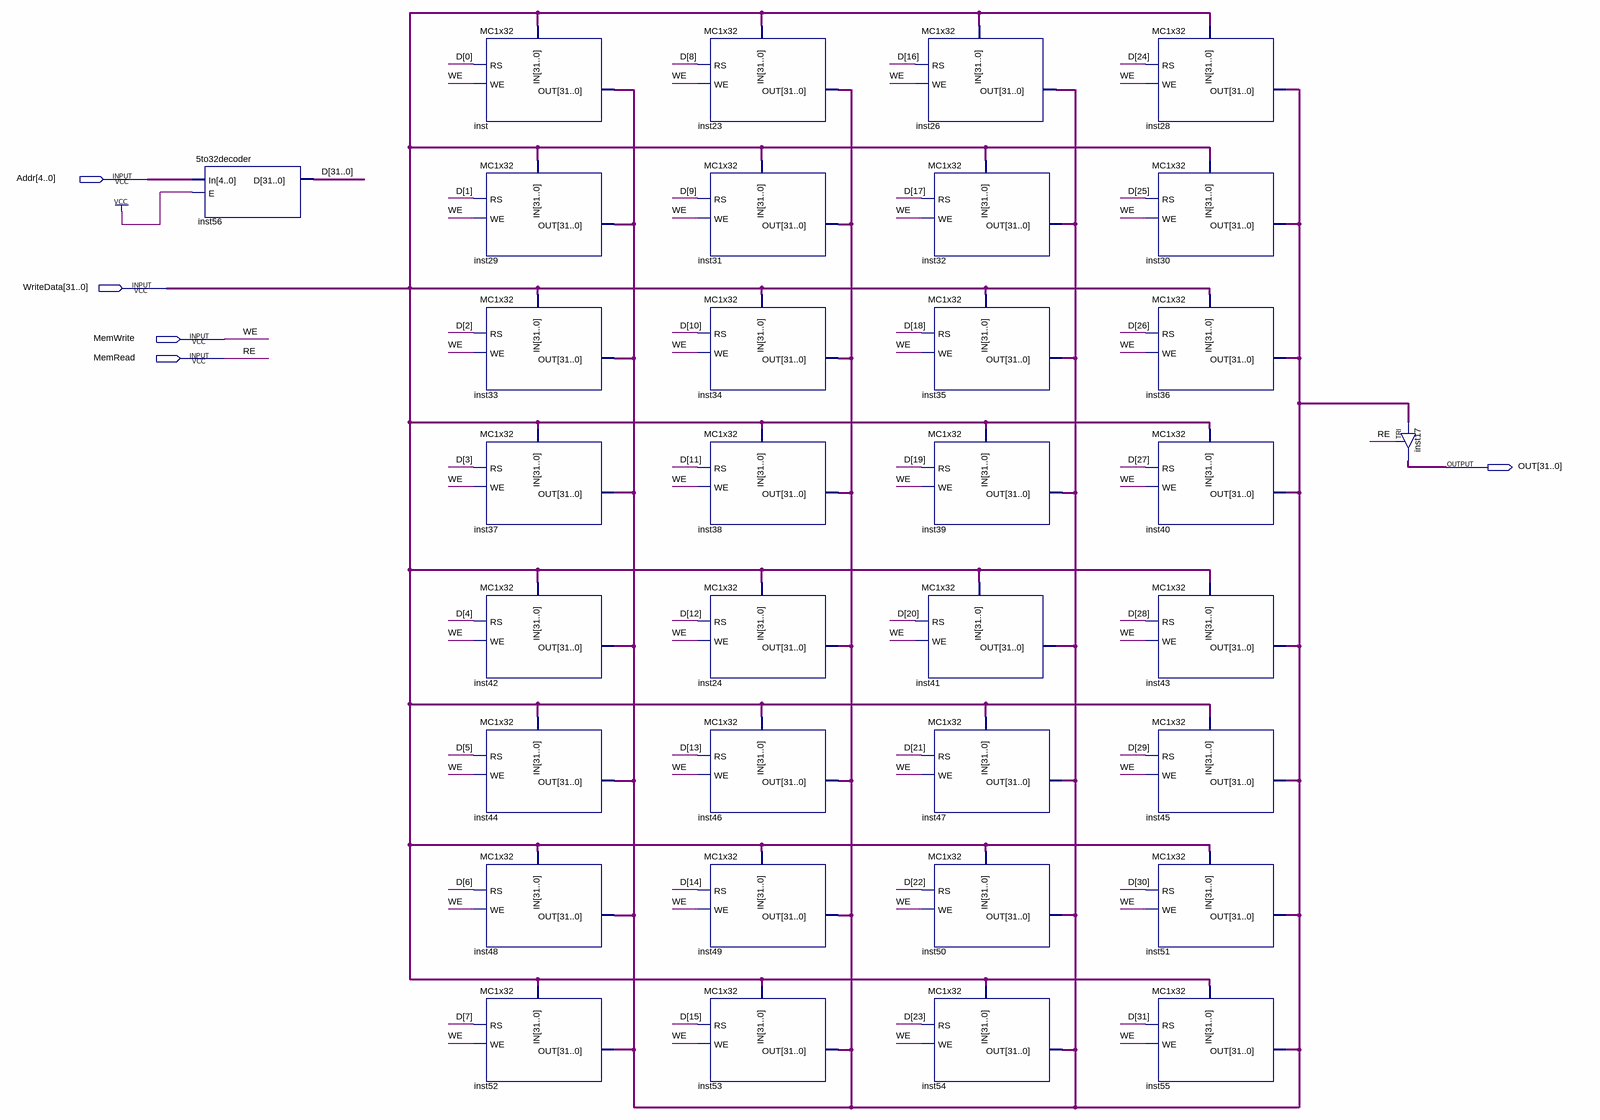
[diagram p0: schematic sheet]
// Quartus schematic RAM32x32.bdf as structural Verilog: 34 symbols, 5 pins
module RAM32x32 (
  input  [4:0] Addr,
  input  [31:0] WriteData,
  input  MemWrite,
  input  MemRead,
  output [31:0] OUT
);

  wire [31:0] D, inst_out;

  \5to32decoder  inst56 (.In(Addr), .E(1'b1), .D(D));
  MC1x32 inst (.RS(D[0]), .IN(WriteData), .WE(MemWrite), .OUT(inst_out));
  MC1x32 inst29 (.RS(D[1]), .IN(WriteData), .WE(MemWrite), .OUT(inst_out));
  MC1x32 inst33 (.RS(D[2]), .IN(WriteData), .WE(MemWrite), .OUT(inst_out));
  MC1x32 inst37 (.RS(D[3]), .IN(WriteData), .WE(MemWrite), .OUT(inst_out));
  MC1x32 inst42 (.RS(D[4]), .IN(WriteData), .WE(MemWrite), .OUT(inst_out));
  MC1x32 inst44 (.RS(D[5]), .IN(WriteData), .WE(MemWrite), .OUT(inst_out));
  MC1x32 inst48 (.RS(D[6]), .IN(WriteData), .WE(MemWrite), .OUT(inst_out));
  MC1x32 inst52 (.RS(D[7]), .IN(WriteData), .WE(MemWrite), .OUT(inst_out));
  MC1x32 inst23 (.RS(D[8]), .IN(WriteData), .WE(MemWrite), .OUT(inst_out));
  MC1x32 inst31 (.RS(D[9]), .IN(WriteData), .WE(MemWrite), .OUT(inst_out));
  MC1x32 inst34 (.RS(D[10]), .IN(WriteData), .WE(MemWrite), .OUT(inst_out));
  MC1x32 inst38 (.RS(D[11]), .IN(WriteData), .WE(MemWrite), .OUT(inst_out));
  MC1x32 inst24 (.RS(D[12]), .IN(WriteData), .WE(MemWrite), .OUT(inst_out));
  MC1x32 inst46 (.RS(D[13]), .IN(WriteData), .WE(MemWrite), .OUT(inst_out));
  MC1x32 inst49 (.RS(D[14]), .IN(WriteData), .WE(MemWrite), .OUT(inst_out));
  MC1x32 inst53 (.RS(D[15]), .IN(WriteData), .WE(MemWrite), .OUT(inst_out));
  MC1x32 inst26 (.RS(D[16]), .IN(WriteData), .WE(MemWrite), .OUT(inst_out));
  MC1x32 inst32 (.RS(D[17]), .IN(WriteData), .WE(MemWrite), .OUT(inst_out));
  MC1x32 inst35 (.RS(D[18]), .IN(WriteData), .WE(MemWrite), .OUT(inst_out));
  MC1x32 inst39 (.RS(D[19]), .IN(WriteData), .WE(MemWrite), .OUT(inst_out));
  MC1x32 inst41 (.RS(D[20]), .IN(WriteData), .WE(MemWrite), .OUT(inst_out));
  MC1x32 inst47 (.RS(D[21]), .IN(WriteData), .WE(MemWrite), .OUT(inst_out));
  MC1x32 inst50 (.RS(D[22]), .IN(WriteData), .WE(MemWrite), .OUT(inst_out));
  MC1x32 inst54 (.RS(D[23]), .IN(WriteData), .WE(MemWrite), .OUT(inst_out));
  MC1x32 inst28 (.RS(D[24]), .IN(WriteData), .WE(MemWrite), .OUT(inst_out));
  MC1x32 inst30 (.RS(D[25]), .IN(WriteData), .WE(MemWrite), .OUT(inst_out));
  MC1x32 inst36 (.RS(D[26]), .IN(WriteData), .WE(MemWrite), .OUT(inst_out));
  MC1x32 inst40 (.RS(D[27]), .IN(WriteData), .WE(MemWrite), .OUT(inst_out));
  MC1x32 inst43 (.RS(D[28]), .IN(WriteData), .WE(MemWrite), .OUT(inst_out));
  MC1x32 inst45 (.RS(D[29]), .IN(WriteData), .WE(MemWrite), .OUT(inst_out));
  MC1x32 inst51 (.RS(D[30]), .IN(WriteData), .WE(MemWrite), .OUT(inst_out));
  MC1x32 inst55 (.RS(D[31]), .IN(WriteData), .WE(MemWrite), .OUT(inst_out));
  TRI inst17[31:0] (.IN(inst_out), .OE(MemRead), .OUT(OUT));

  // Other names for the same wires on the sheet: RE = MemRead; WE = MemWrite
endmodule
